# Altium project DAL_OBC_V10.PrjPcb (part 6 of 9)

## Sheet USB_CAMERA.SchDoc
size 420 x 297 mm; SheetNumber: 16; SheetTotal: 34
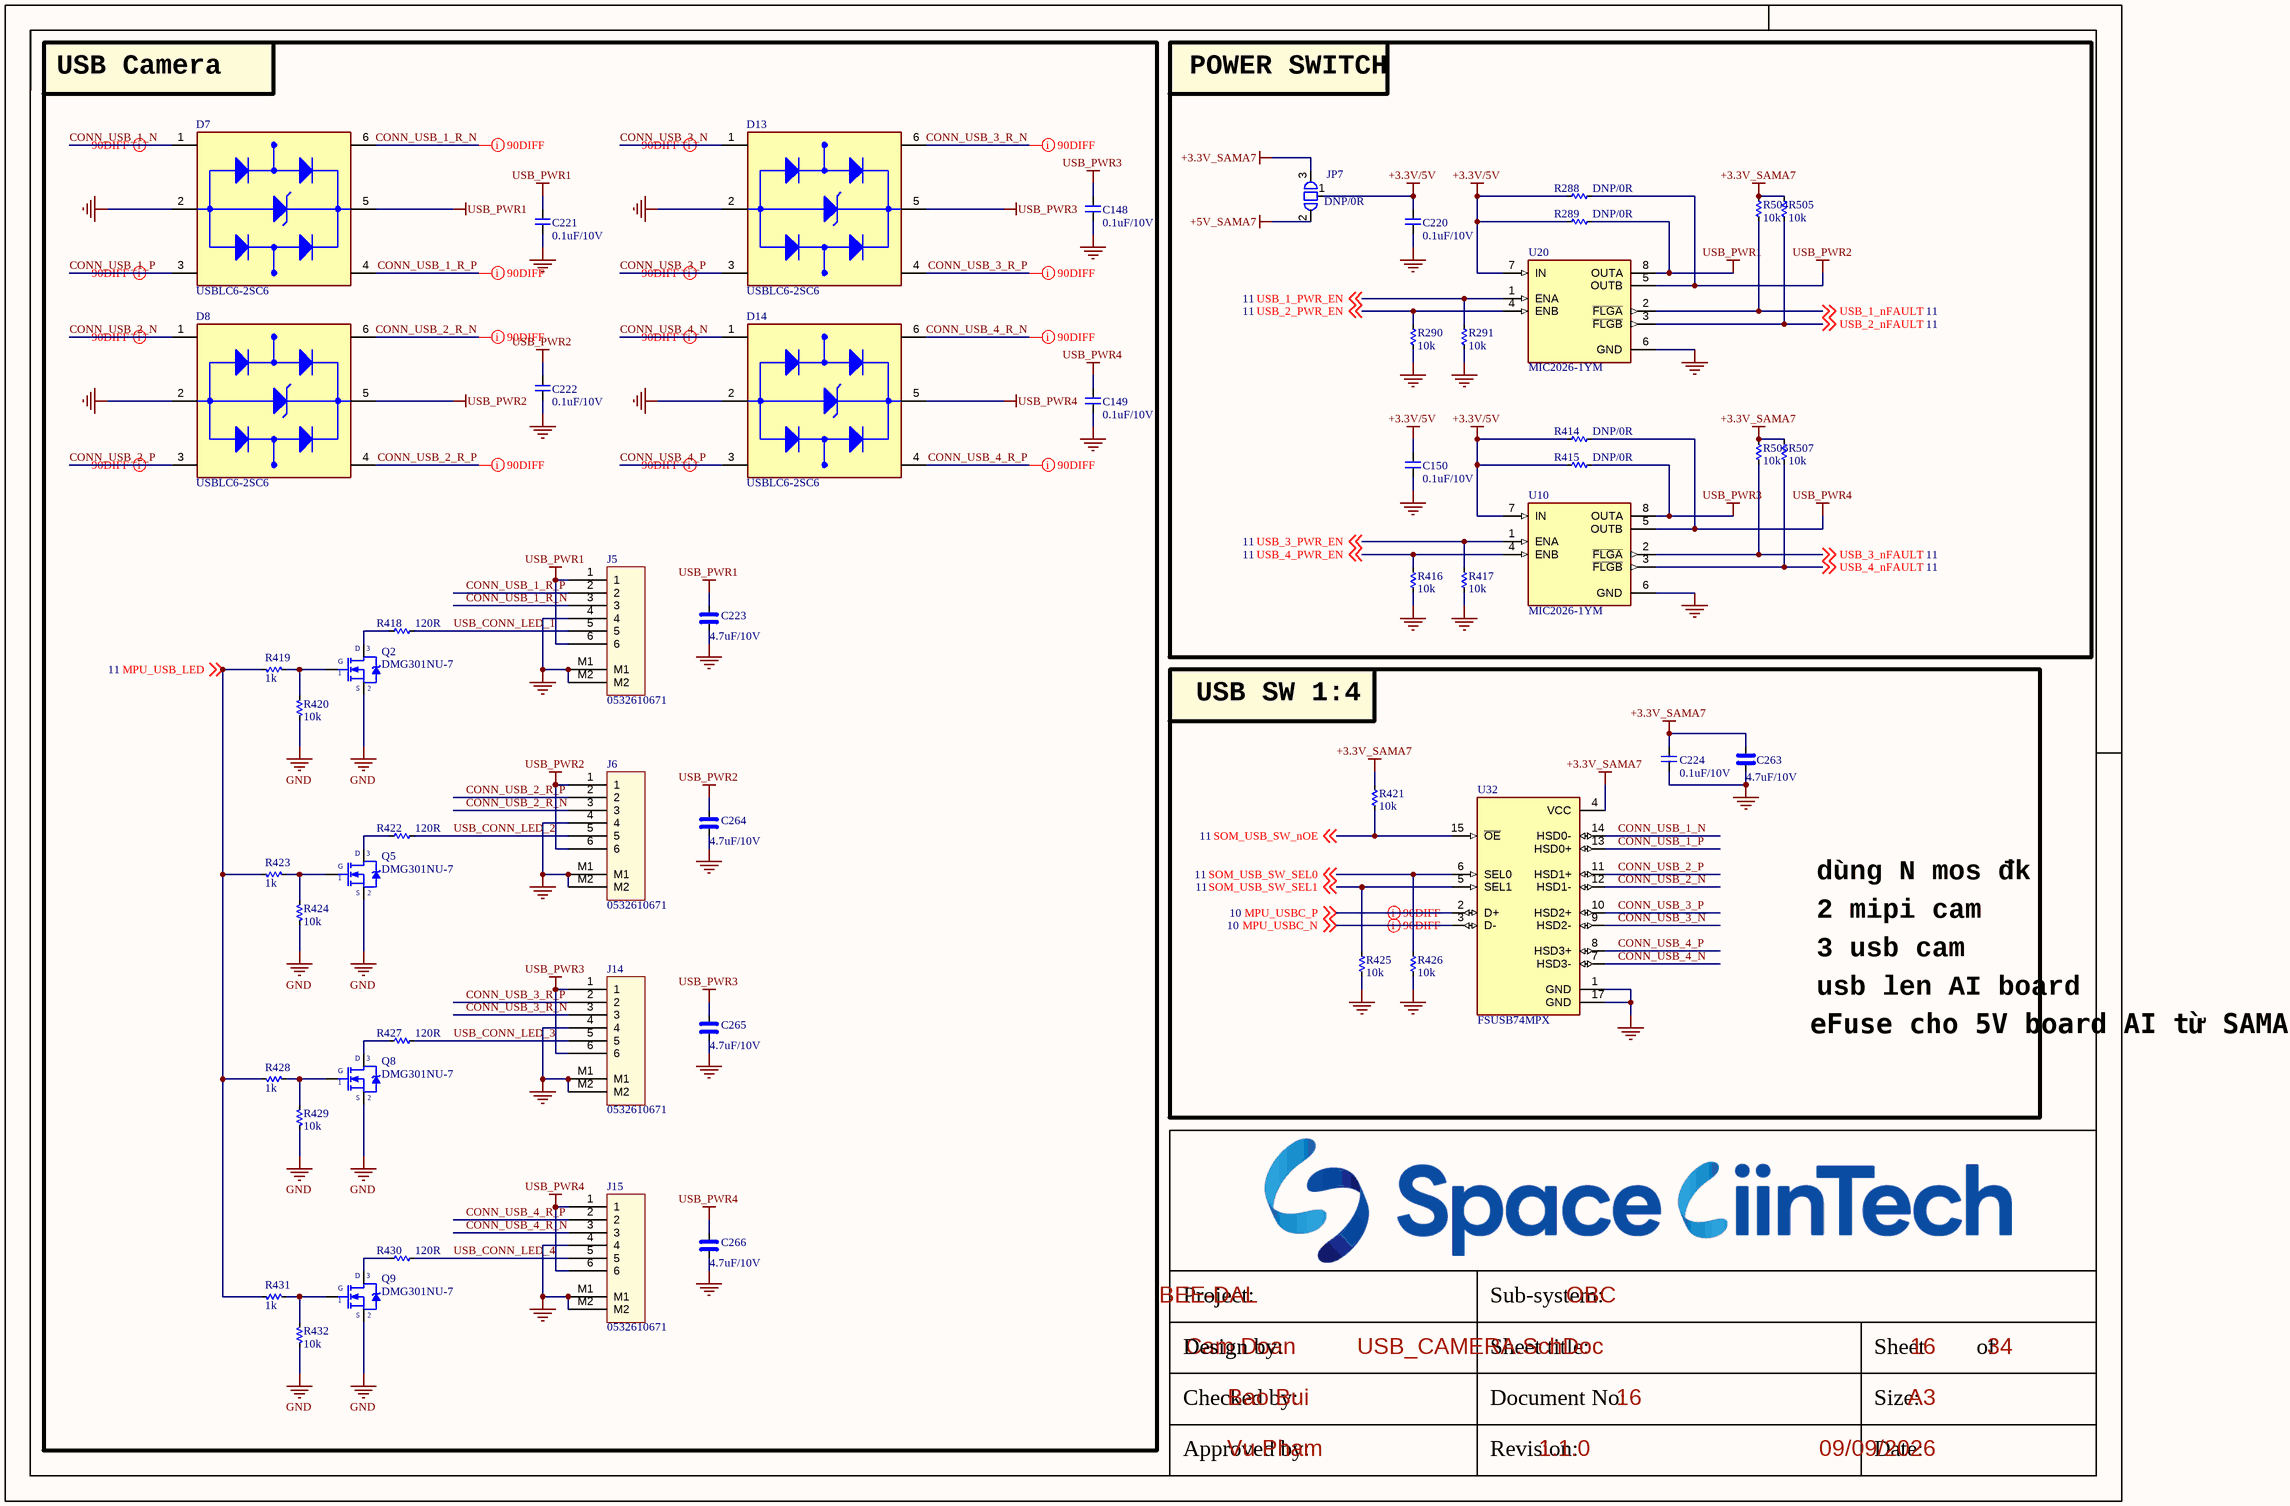
[diagram p14: USB_CAMERA.SchDoc]

### Parts
C148  0.1uF/10V  [CAP_C_1005X50_L]
C149  0.1uF/10V  [CAP_C_1005X50_L]
C150  0.1uF/10V  [CAP_C_1005X50_L]
C220  0.1uF/10V  [CAP_C_1005X50_L]
C221  0.1uF/10V  [CAP_C_1005X50_L]
C222  0.1uF/10V  [CAP_C_1005X50_L]
C223  4.7uF/10V  [CAP_C_1005X60]
C224  0.1uF/10V  [CAP_C_1005X50_L]
C263  4.7uF/10V  [CAP_C_1005X60]
C264  4.7uF/10V  [CAP_C_1005X60]
C265  4.7uF/10V  [CAP_C_1005X60]
C266  4.7uF/10V  [CAP_C_1005X60]
D7  USBLC6-2SC6  [SOT95P280X145-6N]
D8  USBLC6-2SC6  [SOT95P280X145-6N]
D13  USBLC6-2SC6  [SOT95P280X145-6N]
D14  USBLC6-2SC6  [SOT95P280X145-6N]
J5  0532610671  [MOLEX_0532610671]
J6  0532610671  [MOLEX_0532610671]
J14  0532610671  [MOLEX_0532610671]
J15  0532610671  [MOLEX_0532610671]
JP7  DNP/0R  [JUMPER_1-2_1608X60]
Q2  DMG301NU-7  [SOT95P240X120-3N]
Q5  DMG301NU-7  [SOT95P240X120-3N]
Q8  DMG301NU-7  [SOT95P240X120-3N]
Q9  DMG301NU-7  [SOT95P240X120-3N]
R288  DNP/0R  [RES_C_1005x30_L]
R289  DNP/0R  [RES_C_1005x30_L]
R290  10k  [RES_C_1005x30_L]
R291  10k  [RES_C_1005x30_L]
R414  DNP/0R  [RES_C_1005x30_L]
R415  DNP/0R  [RES_C_1005x30_L]
R416  10k  [RES_C_1005x30_L]
R417  10k  [RES_C_1005x30_L]
R418  120R  [RES_C_1005x30_L]
R419  1k  [RES_C_1005x30_L]
R420  10k  [RES_C_1005x30_L]
R421  10k  [RES_C_1005X40]
R422  120R  [RES_C_1005x30_L]
R423  1k  [RES_C_1005x30_L]
R424  10k  [RES_C_1005x30_L]
R425  10k  [RES_C_1005X40]
R426  10k  [RES_C_1005X40]
R427  120R  [RES_C_1005x30_L]
R428  1k  [RES_C_1005x30_L]
R429  10k  [RES_C_1005x30_L]
R430  120R  [RES_C_1005x30_L]
R431  1k  [RES_C_1005x30_L]
R432  10k  [RES_C_1005x30_L]
R504  10k  [RES_C_1005x30_L]
R505  10k  [RES_C_1005x30_L]
R506  10k  [RES_C_1005x30_L]
R507  10k  [RES_C_1005x30_L]
U10  MIC2026-1YM  [SOIC127P602X173-8N]
U20  MIC2026-1YM  [SOIC127P602X173-8N]
U32  FSUSB74MPX  [QFN50P300X300X80-17N]

### Blocks framed on the sheet
USB Camera: C148 C149 C221-C223 C264-C266 D7 D8 D13 D14 J5 J6 J14 J15 Q2 Q5 Q8 Q9 R418-R420 R422-R424 R427-R432
POWER SWITCH: C150 C220 JP7 R288-R291 R414-R417 R504-R507 U10 U20

### Nets
+3.3V/5V: C150.2 C220.2 JP7.1 R288.2 R289.2 R414.2 R415.2 U10.7(IN) U20.7(IN)
+3.3V_SAMA7: C224.2 C263.2 JP7.3 R421.1 R504.1 R505.1 R506.1 R507.1 U32.4(VCC)
+5V_SAMA7: JP7.2
GND: C148.1 C149.1 C150.1 C220.1 C221.1 C222.1 C223.2 C224.1 C263.1 C264.2 C265.2 C266.2 D7.2(GND) D8.2(GND) D13.2(GND) D14.2(GND) J5.4 J5.M1 J5.M2 J6.4 J6.M1 J6.M2 J14.4 J14.M1 J14.M2 J15.4 J15.M1 J15.M2 Q2.2(S) Q5.2(S) Q8.2(S) Q9.2(S) R290.2 R291.2 R416.2 R417.2 R420.1 R424.1 R425.2 R426.2 R429.1 R432.1 U10.6(GND) U20.6(GND) U32.1(GND) U32.17(GND)  [project net AGND]
USB_PWR1: C221.2 C223.1 D7.5(VBUS) J5.1 J5.6 R289.1 U20.8(OUTA)
USB_PWR2: C222.2 C264.1 D8.5(VBUS) J6.1 J6.6 R288.1 U20.5(OUTB)
USB_PWR3: C148.2 C265.1 D13.5(VBUS) J14.1 J14.6 R415.1 U10.8(OUTA)
USB_PWR4: C149.2 C266.1 D14.5(VBUS) J15.1 J15.6 R414.1 U10.5(OUTB)
CONN_USB_1_N: D7.1(I/O1_IN) U32.14(HSD0-)
CONN_USB_1_P: D7.3(I/O2_IN) U32.13(HSD0+)
CONN_USB_1_R_N: D7.6(I/O1_OUT) J5.3
CONN_USB_1_R_P: D7.4(I/O2_OUT) J5.2
CONN_USB_2_N: D8.1(I/O1_IN) U32.12(HSD1-)
CONN_USB_2_P: D8.3(I/O2_IN) U32.11(HSD1+)
CONN_USB_2_R_N: D8.6(I/O1_OUT) J6.3
CONN_USB_2_R_P: D8.4(I/O2_OUT) J6.2
CONN_USB_3_N: D13.1(I/O1_IN) U32.9(HSD2-)
CONN_USB_3_P: D13.3(I/O2_IN) U32.10(HSD2+)
CONN_USB_3_R_N: D13.6(I/O1_OUT) J14.3
CONN_USB_3_R_P: D13.4(I/O2_OUT) J14.2
CONN_USB_4_N: D14.1(I/O1_IN) U32.7(HSD3-)
CONN_USB_4_P: D14.3(I/O2_IN) U32.8(HSD3+)
CONN_USB_4_R_N: D14.6(I/O1_OUT) J15.3
CONN_USB_4_R_P: D14.4(I/O2_OUT) J15.2
MPU_USB_LED: R419.1 R423.1 R428.1 R431.1 ; off-sheet MPU_USB_LED
MPU_USBC_N: U32.3(D-) ; off-sheet MPU_USBC_N
MPU_USBC_P: U32.2(D+) ; off-sheet MPU_USBC_P
SOM_USB_SW_nOE: R421.2 U32.15(~{OE}) ; off-sheet SOM_USB_SW_nOE
SOM_USB_SW_SEL0: R426.1 U32.6(SEL0) ; off-sheet SOM_USB_SW_SEL0
SOM_USB_SW_SEL1: R425.1 U32.5(SEL1) ; off-sheet SOM_USB_SW_SEL1
USB_1_nFAULT: R504.2 U20.2(~{FLGA}) ; off-sheet USB_1_nFAULT
USB_1_PWR_EN: R291.1 U20.1(ENA) ; off-sheet USB_1_PWR_EN
USB_2_nFAULT: R505.2 U20.3(~{FLGB}) ; off-sheet USB_2_nFAULT
USB_2_PWR_EN: R290.1 U20.4(ENB) ; off-sheet USB_2_PWR_EN
USB_3_nFAULT: R506.2 U10.2(~{FLGA}) ; off-sheet USB_3_nFAULT
USB_3_PWR_EN: R417.1 U10.1(ENA) ; off-sheet USB_3_PWR_EN
USB_4_nFAULT: R507.2 U10.3(~{FLGB}) ; off-sheet USB_4_nFAULT
USB_4_PWR_EN: R416.1 U10.4(ENB) ; off-sheet USB_4_PWR_EN
USB_CONN_LED_1: J5.5 R418.2
USB_CONN_LED_2: J6.5 R422.2
USB_CONN_LED_3: J14.5 R427.2
USB_CONN_LED_4: J15.5 R430.2
NetQ2_1: Q2.1(G) R419.2 R420.2
NetQ2_3: Q2.3(D) R418.1
NetQ5_1: Q5.1(G) R423.2 R424.2
NetQ5_3: Q5.3(D) R422.1
NetQ8_1: Q8.1(G) R428.2 R429.2
NetQ8_3: Q8.3(D) R427.1
NetQ9_1: Q9.1(G) R431.2 R432.2
NetQ9_3: Q9.3(D) R430.1

### Layout directives
differential pair; differential pair class DIFF90: CONN_USB_1_N, CONN_USB_1_P, CONN_USB_1_R_N, CONN_USB_1_R_P, CONN_USB_2_N, CONN_USB_2_P, CONN_USB_2_R_N, CONN_USB_2_R_P, CONN_USB_3_N, CONN_USB_3_P, CONN_USB_3_R_N, CONN_USB_3_R_P, CONN_USB_4_N, CONN_USB_4_P, CONN_USB_4_R_N, CONN_USB_4_R_P, MPU_USBC_N, MPU_USBC_P

### Notes on the sheet
- USB SW 1:4
- dùng N mos đk
- 2 mipi cam
- 3 usb cam
- usb len AI board
- eFuse cho 5V board AI từ SAMA7
- Project:
- Sub-system:
- Design by:
- Sheet title:
- Sheet
- of
- Checked by:
- Approved by:
- Revision:
- Document No:
- Size:
- Date:
- A3

### Library data of the parts
C148-C150 C220-C222 = _CAP_C_2: CAP
C223 C263-C266 = _CAP_C_High_2: CAP CHIP High Value
C224 = _CAP_C_2: CAP CHIP
D7 D8 D13 D14 = USBLC6-2SC6: 17V Clamp 5A (8/20Âµs) Ipp Tvs Diode Surface Mount SOT-23-6; MF: STMicroelectronics; Value: *; SnapEDA_Link: https://www.snapeda.com/parts/USBLC6-2SC6/STMicroelectronics/view-part/?ref=snap; Check_prices: https://www.snapeda.com/parts/USBLC6-2SC6/STMicroelectronics/view-part/?ref=eda; Purchase-URL: https://pricing.snapeda.com/search/part/USBLC6-2SC6/?ref=eda; Price: None; Availability: In Stock; Package: SOT-23-6 STMicroelectronics; MP: USBLC6-2SC6
J5 J6 J14 J15 = Header 6x1_2M
JP7 = JUMPER_1_2
Q2 Q5 Q8 Q9 = MOSFET_N_GSD
R288-R291 R414-R432 R504-R507 = _RES_B_2: RES
U10 U20 = IC_PWRSW_MIC2026-1YM: Power Switch/Driver 1:2 N-Channel 1.25A 8-SOIC; MF: Microchip; SnapEDA_Link: https://www.snapeda.com/parts/MIC2026-1YM/Microchip/view-part/?ref=snap; Package: SO-8 Microchip; Value: *; MP: MIC2026-1YM; Check_prices: https://www.snapeda.com/parts/MIC2026-1YM/Microchip/view-part/?ref=eda
U32 = IC_USB_SW_FSUSB74MPX: USB Switch IC 1 Channel 16-MLP (3x3); MF: ON Semiconductor; SnapEDA_Link: https://www.snapeda.com/parts/FSUSB74MPX/Onsemi/view-part/?ref=snap; Package: WQFN-16 ON Semiconductor; Value: *; MP: FSUSB74MPX; Check_prices: https://www.snapeda.com/parts/FSUSB74MPX/Onsemi/view-part/?ref=eda

## Sheet DEBUG_CONSOLE.SchDoc
size 420 x 297 mm; SheetNumber: 17; SheetTotal: 34
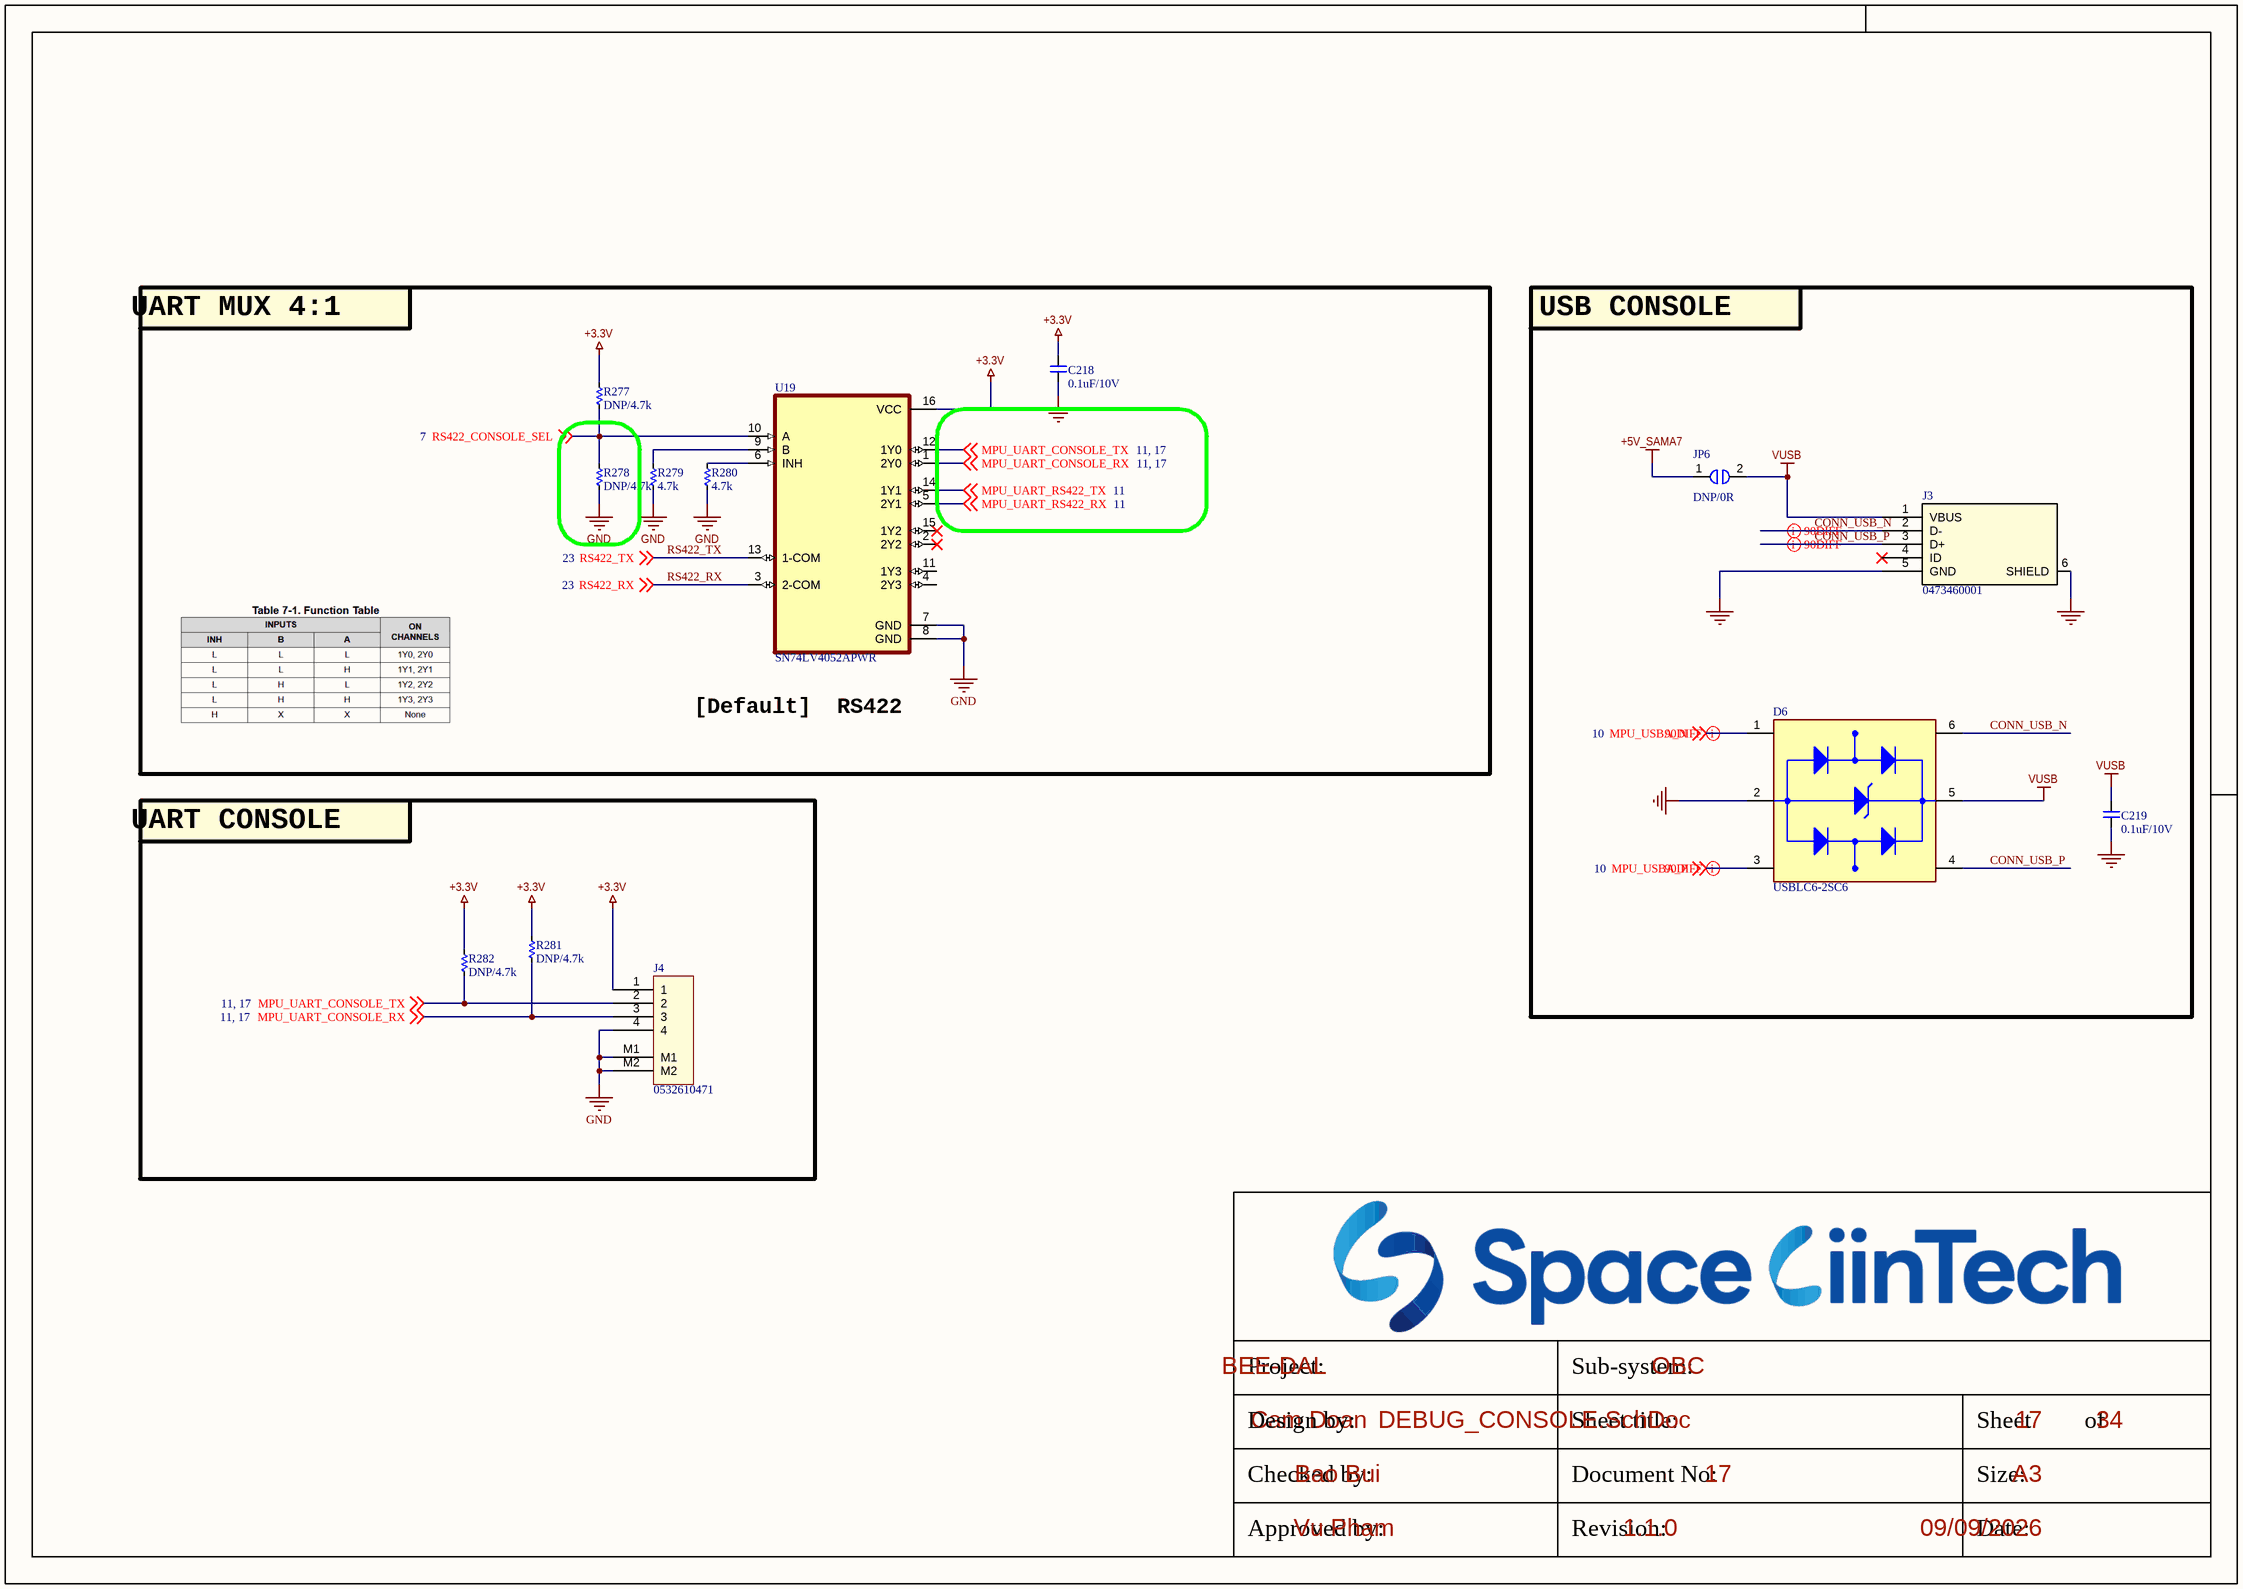
[diagram p15: DEBUG_CONSOLE.SchDoc]

### Parts
C218  0.1uF/10V  [CAP_C_1005X50_L]
C219  0.1uF/10V  [CAP_C_1005X50_L]
D6  USBLC6-2SC6  [SOT95P280X145-6N]
J3  0473460001  [47346-0001_MOL]
J4  0532610471  [MOLEX_0532610471]
JP6  DNP/0R  [RES_C_1608X60]
R277  DNP/4.7k  [RES_C_1005x30_L]
R278  DNP/4.7k  [RES_C_1005x30_L]
R279  4.7k  [RES_C_1005x30_L]
R280  4.7k  [RES_C_1005x30_L]
R281  DNP/4.7k  [RES_C_1005x30_L]
R282  DNP/4.7k  [RES_C_1005x30_L]
U19  SN74LV4052APWR  [SOP65P640X120-16N]

### Blocks framed on the sheet
UART MUX 4:1: C218 R277-R280 U19
USB CONSOLE: C219 D6 J3 JP6
UART CONSOLE: J4 R281 R282

### Nets
+3.3V: C218.2 J4.1 R277.1 R281.1 R282.1 U19.16(VCC)
+5V_SAMA7: JP6.1
GND: C218.1 C219.1 D6.2(GND) J3.5(GND) J3.6(SHIELD) J4.4 J4.M1 J4.M2 R278.2 R279.2 R280.2 U19.7(GND) U19.8(GND)  [project net AGND]
VUSB: C219.2 D6.5(VBUS) J3.1(VBUS) JP6.2
CONN_USB_N: D6.6(I/O1_OUT) J3.2(D-)
CONN_USB_P: D6.4(I/O2_OUT) J3.3(D+)
MPU_UART_CONSOLE_RX: J4.3 R281.2 U19.1(2Y0) ; off-sheet MPU_UART_CONSOLE_RX
MPU_UART_CONSOLE_TX: J4.2 R282.2 U19.12(1Y0) ; off-sheet MPU_UART_CONSOLE_TX
MPU_UART_RS422_RX: U19.5(2Y1) ; off-sheet MPU_UART_RS422_RX
MPU_UART_RS422_TX: U19.14(1Y1) ; off-sheet MPU_UART_RS422_TX
MPU_USBA_N: D6.1(I/O1_IN) ; off-sheet MPU_USBA_N
MPU_USBA_P: D6.3(I/O2_IN) ; off-sheet MPU_USBA_P
RS422_CONSOLE_SEL: R277.2 R278.1 U19.10(A) ; off-sheet RS422_CONSOLE_SEL
RS422_RX: U19.3(2-COM) ; off-sheet RS422_RX
RS422_TX: U19.13(1-COM) ; off-sheet RS422_TX
NetR279_1: R279.1 U19.9(B)
NetR280_1: R280.1 U19.6(INH)

Not connected (* = marked no-connect by the designer): J3 4(ID)*; U19 2(2Y2)* 4(2Y3) 11(1Y3) 15(1Y2)*

### Layout directives
differential pair; differential pair class DIFF90: CONN_USB_N, CONN_USB_P, MPU_USBA_N, MPU_USBA_P

### Notes on the sheet
- [Default]  RS422
- Project:
- Sub-system:
- Design by:
- Sheet title:
- Sheet
- of
- Checked by:
- Approved by:
- Revision:
- Document No:
- Size:
- Date:
- A3

### Library data of the parts
C218 C219 = _CAP_C_2: CAP
D6 = USBLC6-2SC6: as D7 on sheet USB_CAMERA; Value: *; SnapEDA_Link: https://www.snapeda.com/parts/USBLC6-2SC6/STMicroelectronics/view-part/?ref=snap; Check_prices: https://www.snapeda.com/parts/USBLC6-2SC6/STMicroelectronics/view-part/?ref=eda; Purchase-URL: https://pricing.snapeda.com/search/part/USBLC6-2SC6/?ref=eda; Price: None; Availability: In Stock; Package: SOT-23-6 STMicroelectronics; MP: USBLC6-2SC6
J3 = USB_micro: No Description Available; Mfr_Name: Molex Connector Corporation; RefDes: RefDes; Type: Type
J4 = Header 4x1_2M
JP6 = JUMPER_1_1
R277-R282 = _RES_B_2: RES
U19 = SN74LV4052APWR: 5-V, 4:1, 2-channel analog multiplexer; MF: Texas Instruments; SnapEDA_Link: https://www.snapeda.com/parts/SN74LV4052APWR/Texas+Instruments/view-part/?ref=snap; Package: TSSOP-16 Texas Instruments; Value: *; MP: SN74LV4052APWR; Check_prices: https://www.snapeda.com/parts/SN74LV4052APWR/Texas+Instruments/view-part/?ref=eda

## Sheet TEMP.SchDoc
size 420 x 297 mm; SheetNumber: 18; SheetTotal: 34
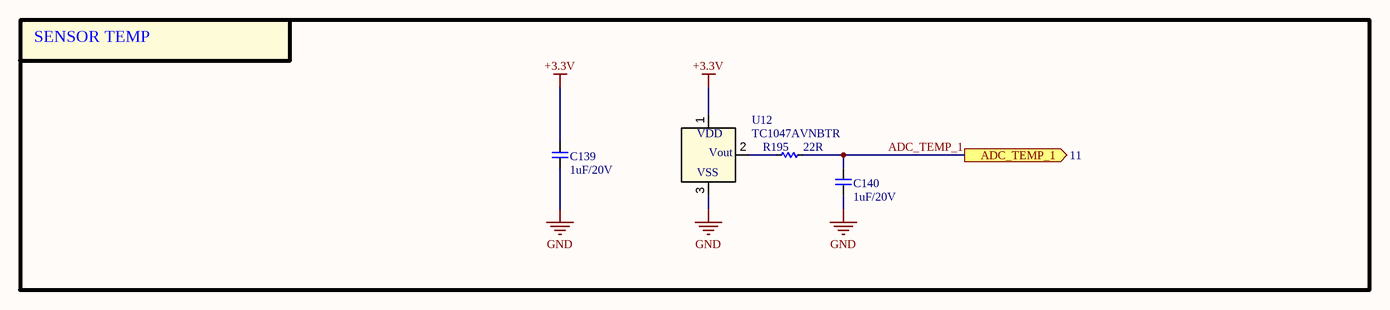
[diagram p16: TEMP.SchDoc]

### Parts
C139  1uF/20V  [CAP_C_1005X50_L]
C140  1uF/20V  [CAP_C_1005X50_L]
R195  22R  [RES_C_1005x30_L]
U12  TC1047AVNBTR  [SOT-23_MC_MCH]

### Blocks framed on the sheet
SENSOR TEMP: C139 C140 R195 U12

### Ports
ADC_TEMP_1 (out, see 11)

### Nets
+3.3V: C139.2 U12.1(VDD)
GND: C139.1 C140.1 U12.3(VSS)  [project net AGND]
ADC_TEMP_1: C140.2 R195.2 ; port ADC_TEMP_1
NetR195_1: R195.1 U12.2(VOUT)

### Notes on the sheet
- Project:
- Sub-system:
- Design by:
- Sheet title:
- Sheet
- of
- Checked by:
- Approved by:
- Revision:
- Document No:
- Size:
- Date:
- A3
- (in symbol TC1047AVNBTR) Vout

### Library data of the parts
C139 C140 = _CAP_C_2: CAP CHIP
R195 = _RES_B_2: RES
U12 = TC1047AVNBTR: SENSOR ANALOG -40C-125C SOT23-3; Manufacturer_Name: Microchip; Copyright: Copyright (C) 2025 Ultra Librarian. All rights reserved.; Manufacturer_Part_Number: TC1047AVNBTR; RefDes: RefDes; Type: Type

## Sheet RTC.SchDoc
size 420 x 297 mm; SheetNumber: 19; SheetTotal: 34
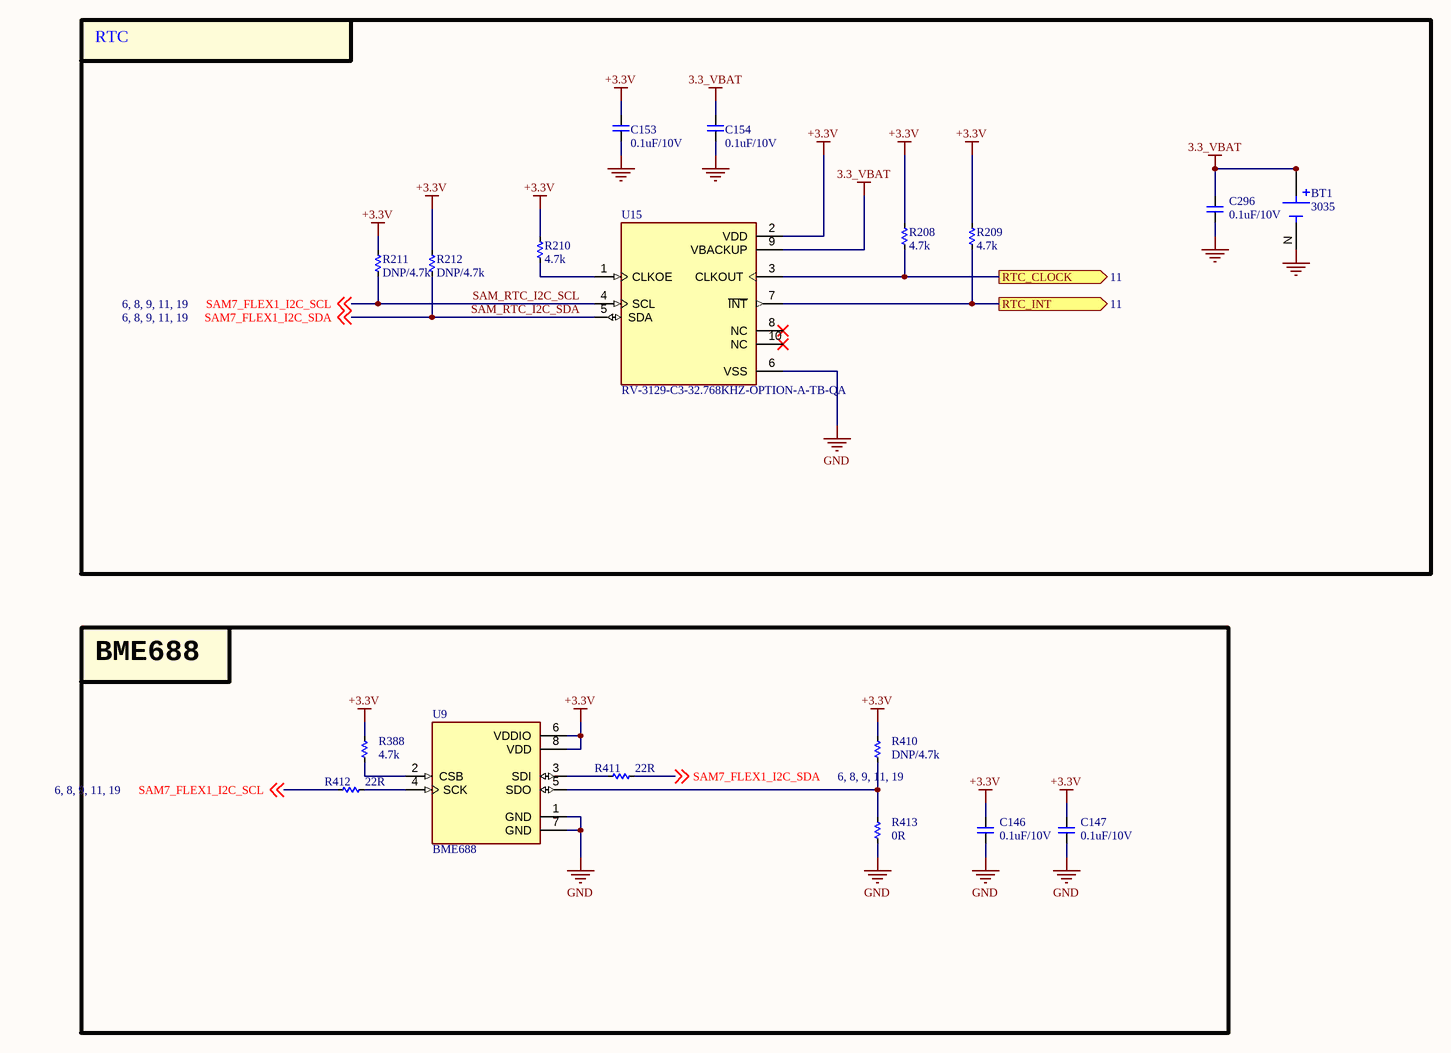
[diagram p17: RTC.SchDoc]

### Parts
BT1  3035  [BAT_3035]
C146  0.1uF/10V  [CAP_C_1005X50_L]
C147  0.1uF/10V  [CAP_C_1005X50_L]
C153  0.1uF/10V  [CAP_C_1005X50_L]
C154  0.1uF/10V  [CAP_C_1005X50_L]
C296  0.1uF/10V  [CAP_C_1005X50_L]
R208  4.7k  [RES_C_1005x30_L]
R209  4.7k  [RES_C_1005x30_L]
R210  4.7k  [RES_C_1005x30_L]
R211  DNP/4.7k  [RES_C_1005x30_L]
R212  DNP/4.7k  [RES_C_1005x30_L]
R388  4.7k  [RES_C_1005X40]
R410  DNP/4.7k  [RES_C_1005X40]
R411  22R  [RES_C_1005X40]
R412  22R  [RES_C_1005X40]
R413  0R  [RES_C_1005x30_L]
U9  BME688  [IC_BME688]
U15  RV-3129-C3-32.768KHZ-OPTION-A-TB-QA  [IC_RV-3129-C3-32.768KHZ-OPTION-A-TB-QA]

### Blocks framed on the sheet
RTC: BT1 C153 C154 C296 R208-R212 U15
BME688: C146 C147 R388 R410-R413 U9

### Ports
RTC_CLOCK (out, see 11), RTC_INT (out, see 11)

### Nets
3.3_VBAT: BT1.P1(POS) BT1.P2(POS) C154.2 C296.2 U15.9(VBACKUP)
+3.3V: C146.2 C147.2 C153.2 R208.1 R209.1 R210.1 R211.1 R212.1 R388.1 R410.1 U9.6(VDDIO) U9.8(VDD) U15.2(VDD)
GND: BT1.N(NEG) C146.1 C147.1 C153.1 C154.1 C296.1 R413.2 U9.1(GND) U9.7(GND) U15.6(VSS)  [project net AGND]
SAM_RTC_I2C_SCL: R211.2 R412.1 U15.4(SCL) ; off-sheet SAM7_FLEX1_I2C_SCL  [also labelled SAM7_FLEX1_I2C_SCL]
SAM_RTC_I2C_SDA: R212.2 R411.2 U15.5(SDA) ; off-sheet SAM7_FLEX1_I2C_SDA  [also labelled SAM7_FLEX1_I2C_SDA]
NetR64_1: R209.2 U15.7(~{INT}) ; port RTC_INT
NetR116_1: R208.2 U15.3(CLKOUT) ; port RTC_CLOCK
NetR210_2: R210.2 U15.1(CLKOE)
NetR388_2: R388.2 U9.2(CSB)
NetR410_2: R410.2 R413.1 U9.5(SDO)
NetR411_1: R411.1 U9.3(SDI)
NetR412_2: R412.2 U9.4(SCK)

Not connected (* = marked no-connect by the designer): U15 8(NC)* 10(NC)*

### Notes on the sheet
- Project:
- Sub-system:
- Design by:
- Sheet title:
- Sheet
- of
- Checked by:
- Approved by:
- Revision:
- Document No:
- Size:
- Date:
- A3

### Library data of the parts
BT1 = BT_HOLDER_3035: Battery Clip; THM; 20mm Cell; PhosBronze/Nickel | Keystone Electronics 3035; SnapEDA_Link: https://www.snapeda.com/parts/3035/Keystone/view-part/?ref=snap; Package: None; Value: *; MF: Keystone Electronics; MP: 3035; Check_prices: https://www.snapeda.com/parts/3035/Keystone/view-part/?ref=eda
C146 C147 C153 C154 C296 = _CAP_C_2: CAP
R208-R212 R388 R410-R413 = _RES_B_2: RES
U9 = BME688: Gas sensor measuring relative humidity, barometric pressure, ambient temperature and gas (VOC); Package: None; MP: BME688; Price: None; Availability: Unavailable; Value: *
U15 = RV-3129-C3-32.768KHZ-OPTION-A-TB-QA: Real-Time Clock Module with I2C-Bus; MP: RV-3129-C3-32.768KHZ-OPTION-A-TB-QA; Value: *; Price: None; Package: None; Availability: Unavailable